# EAGLE design voice board kombi w gp ordered-210217 (EAGLE 6.5.0)
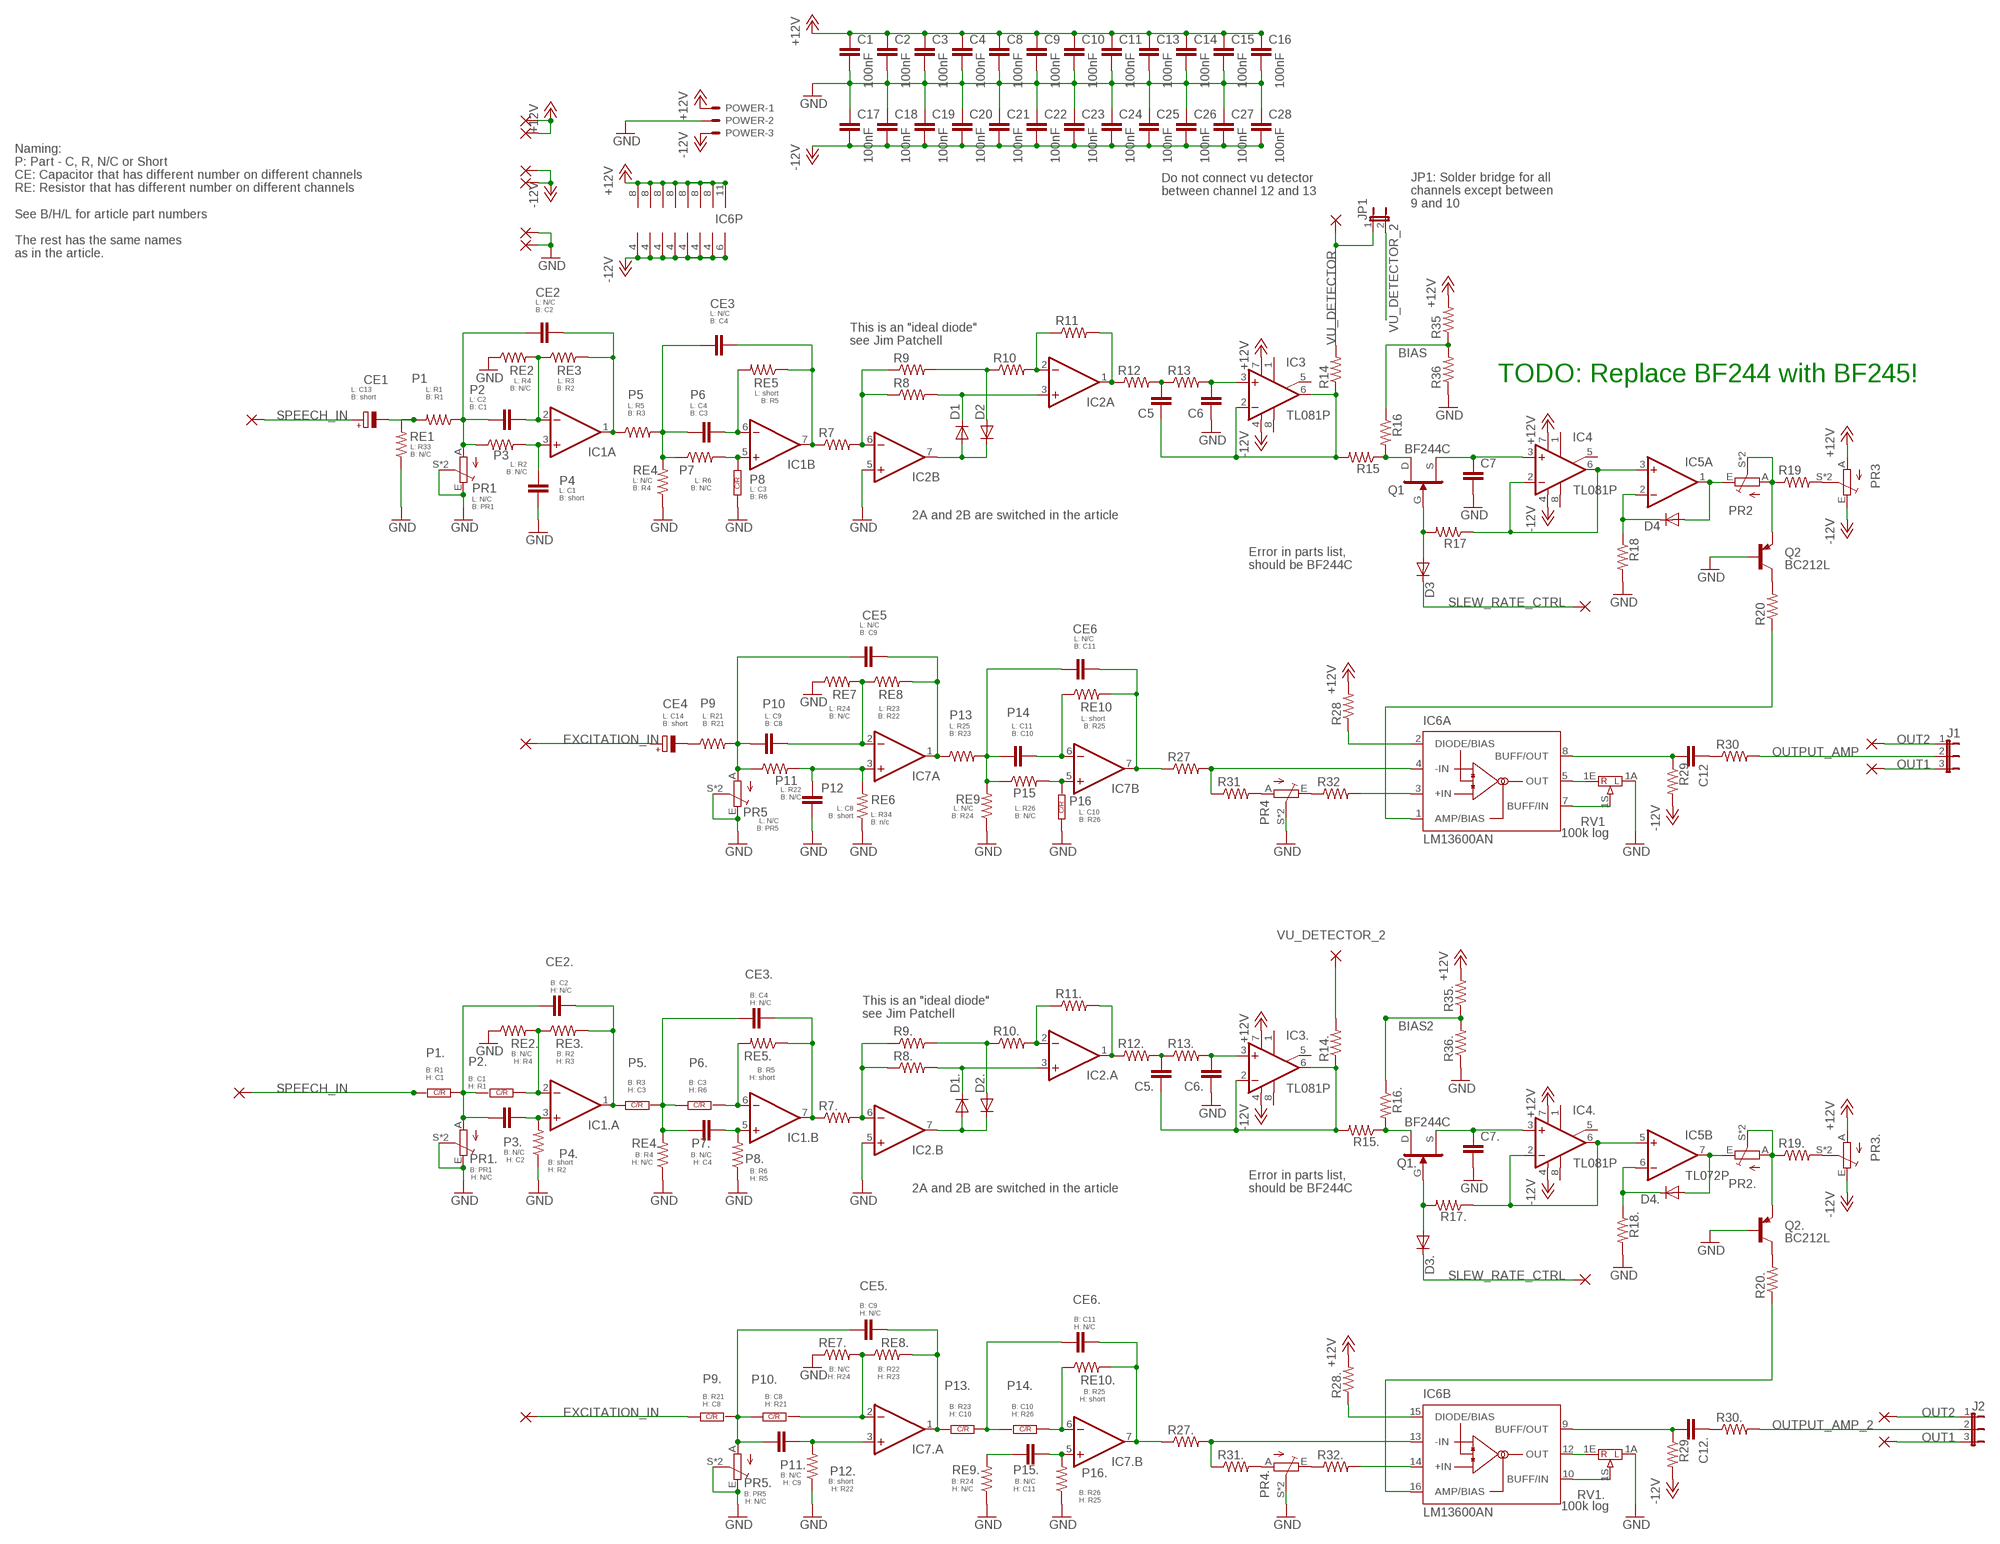
[diagram p0: schematic, sheet 1]

## Parts
C1  100nF  C-EUC0603  [C0603]
C2  100nF  C-EUC0603  [C0603]
C3  100nF  C-EUC0603  [C0603]
C4  100nF  C-EUC0603  [C0603]
C5  C-EU050-035X075  [C050-035X075]
C5.  C-EU050-035X075  [C050-035X075]
C6  C-EU050-035X075  [C050-035X075]
C6.  C-EU050-035X075  [C050-035X075]
C7  C-EU050-035X075  [C050-035X075]
C7.  C-EU050-035X075  [C050-035X075]
C8  100nF  C-EUC0603  [C0603]
C9  100nF  C-EUC0603  [C0603]
C10  100nF  C-EUC0603  [C0603]
C11  100nF  C-EUC0603  [C0603]
C12  C-EU050-035X075  [C050-035X075]
C12.  C-EU050-035X075  [C050-035X075]
C13  100nF  C-EUC0603  [C0603]
C14  100nF  C-EUC0603  [C0603]
C15  100nF  C-EUC0603  [C0603]
C16  100nF  C-EUC0603  [C0603]
C17  100nF  C-EUC0603  [C0603]
C18  100nF  C-EUC0603  [C0603]
C19  100nF  C-EUC0603  [C0603]
C20  100nF  C-EUC0603  [C0603]
C21  100nF  C-EUC0603  [C0603]
C22  100nF  C-EUC0603  [C0603]
C23  100nF  C-EUC0603  [C0603]
C24  100nF  C-EUC0603  [C0603]
C25  100nF  C-EUC0603  [C0603]
C26  100nF  C-EUC0603  [C0603]
C27  100nF  C-EUC0603  [C0603]
C28  100nF  C-EUC0603  [C0603]
CE1  CPOL-EUE2-4  [E2-4]
CE2  C-EU050-035X075  [C050-035X075]
CE2.  C-EU050-035X075  [C050-035X075]
CE3  C-EU050-035X075  [C050-035X075]
CE3.  C-EU050-035X075  [C050-035X075]
CE4  CPOL-EUE2-4  [E2-4]
CE5  C-EU050-035X075  [C050-035X075]
CE5.  C-EU050-035X075  [C050-035X075]
CE6  C-EU050-035X075  [C050-035X075]
CE6.  C-EU050-035X075  [C050-035X075]
D1  DIODE-D-5  [D-5]
D1.  DIODE-D-5  [D-5]
D2  DIODE-D-5  [D-5]
D2.  DIODE-D-5  [D-5]
D3  DIODE-D-5  [D-5]
D3.  DIODE-D-5  [D-5]
D4  DIODE-D-5  [D-5]
D4.  DIODE-D-5  [D-5]
IC1  TL072P  [DIL08]
IC1.  TL072P  [DIL08]
IC2  TL072P  [DIL08]
IC2.  TL072P  [DIL08]
IC3  TL081P  [DIL08]
IC3.  TL081P  [DIL08]
IC4  TL081P  [DIL08]
IC4.  TL081P  [DIL08]
IC5  TL072P  [DIL08]
IC6  LM13600AN  [DIL16]
IC7  TL072P  [DIL08]
IC7.  TL072P  [DIL08]
J1  JP2E  [JP2]
J2  JP2E  [JP2]
JP1  JP1E  [JP1]
P1  R-US_0207/7  [0207/7]
P1.  C-OR-R050_075-035X100  [P050_075-035X100J]
P2  C-EU050-035X075  [C050-035X075]
P2.  C-OR-R050_075-035X100  [P050_075-035X100J]
P3  R-US_0207/7  [0207/7]
P3.  C-EU050-035X075  [C050-035X075]
P4  C-EU050-035X075  [C050-035X075]
P4.  R-US_0207/7  [0207/7]
P5  R-US_0207/7  [0207/7]
P5.  C-OR-R050_075-035X100  [P050_075-035X100J]
P6  C-EU050-035X075  [C050-035X075]
P6.  C-OR-R050_075-035X100  [P050_075-035X100J]
P7  R-US_0207/7  [0207/7]
P7.  C-EU050-035X075  [C050-035X075]
P8  C-OR-R050_075-035X100  [P050_075-035X100J]
P8.  R-US_0207/7  [0207/7]
P9  R-US_0207/7  [0207/7]
P9.  C-OR-R050_075-035X100  [P050_075-035X100J]
P10  C-EU050-035X075  [C050-035X075]
P10.  C-OR-R050_075-035X100  [P050_075-035X100J]
P11  R-US_0207/7  [0207/7]
P11.  C-EU050-035X075  [C050-035X075]
P12  C-EU050-035X075  [C050-035X075]
P12.  R-US_0207/7  [0207/7]
P13  R-US_0207/7  [0207/7]
P13.  C-OR-R050_075-035X100  [P050_075-035X100J]
P14  C-EU050-035X075  [C050-035X075]
P14.  C-OR-R050_075-035X100  [P050_075-035X100J]
P15  R-US_0207/7  [0207/7]
P15.  C-EU050-035X075  [C050-035X075]
P16  C-OR-R050_075-035X100  [P050_075-035X100J]
P16.  R-US_0207/7  [0207/7]
PAD1  WIREPAD2,54/1,1  [2,54/1,1]
PAD2  WIREPAD2,54/1,1  [2,54/1,1]
PAD3  WIREPAD2,54/1,1  [2,54/1,1]
PAD4  WIREPAD2,54/1,1  [2,54/1,1]
PAD5  WIREPAD2,54/1,1  [2,54/1,1]
PAD6  WIREPAD2,54/1,1  [2,54/1,1]
PAD7  WIREPAD2,54/1,1  [2,54/1,1]
PAD8  WIREPAD2,54/1,1  [2,54/1,1]
PAD9  WIREPAD2,54/1,1  [2,54/1,1]
PAD10  WIREPAD2,54/1,1  [2,54/1,1]
PAD11  WIREPAD2,54/1,1  [2,54/1,1]
PAD12  WIREPAD2,54/1,1  [2,54/1,1]
PAD13  WIREPAD2,54/1,1  [2,54/1,1]
PAD14  WIREPAD2,54/1,1  [2,54/1,1]
PAD15  WIREPAD2,54/1,1  [2,54/1,1]
PAD16  WIREPAD2,54/1,1  [2,54/1,1]
PAD17  WIREPAD2,54/1,1  [2,54/1,1]
PAD18  WIREPAD2,54/1,1  [2,54/1,1]
POWER  KK-156-3  [KK-156-3]
PR1  TRIM_EU-PT10-R065  [MULTIPOT_2_J]
PR1.  TRIM_EU-PT10-R065  [MULTIPOT_2_J]
PR2  TRIM_EU-PT10-R065  [MULTIPOT_2_J]
PR2.  TRIM_EU-PT10-R065  [MULTIPOT_2_J]
PR3  TRIM_EU-PT10-R065  [MULTIPOT_2_J]
PR3.  TRIM_EU-PT10-R065  [MULTIPOT_2_J]
PR4  TRIM_EU-PT10-R065  [MULTIPOT_2_J]
PR4.  TRIM_EU-PT10-R065  [MULTIPOT_2_J]
PR5  TRIM_EU-PT10-R065  [MULTIPOT_2_J]
PR5.  TRIM_EU-PT10-R065  [MULTIPOT_2_J]
Q1  BF244C  N-CHANNEL-JFET-JIL-DGSD  [TO92-DGSD-J]
Q1.  BF244C  N-CHANNEL-JFET-JIL-DGSD  [TO92-DGSD-J]
Q2  BC212L  -PNP-TO92-ECB  [TO92-ECB]
Q2.  BC212L  -PNP-TO92-ECB  [TO92-ECB]
R7  R-US_0207/7  [0207/7]
R7.  R-US_0207/7  [0207/7]
R8  R-US_0207/7  [0207/7]
R8.  R-US_0207/7  [0207/7]
R9  R-US_0207/7  [0207/7]
R9.  R-US_0207/7  [0207/7]
R10  R-US_0207/7  [0207/7]
R10.  R-US_0207/7  [0207/7]
R11  R-US_0207/7  [0207/7]
R11.  R-US_0207/7  [0207/7]
R12  R-US_0207/7  [0207/7]
R12.  R-US_0207/7  [0207/7]
R13  R-US_0207/7  [0207/7]
R13.  R-US_0207/7  [0207/7]
R14  R-US_0207/7  [0207/7]
R14.  R-US_0207/7  [0207/7]
R15  R-US_0207/7  [0207/7]
R15.  R-US_0207/7  [0207/7]
R16  R-US_0207/7  [0207/7]
R16.  R-US_0207/7  [0207/7]
R17  R-US_0207/7  [0207/7]
R17.  R-US_0207/7  [0207/7]
R18  R-US_0207/7  [0207/7]
R18.  R-US_0207/7  [0207/7]
R19  R-US_0207/7  [0207/7]
R19.  R-US_0207/7  [0207/7]
R20  R-US_0207/7  [0207/7]
R20.  R-US_0207/7  [0207/7]
R27  R-US_0207/7  [0207/7]
R27.  R-US_0207/7  [0207/7]
R28  R-US_0207/7  [0207/7]
R28.  R-US_0207/7  [0207/7]
R29  R-US_0207/7  [0207/7]
R29.  R-US_0207/7  [0207/7]
R30  R-US_0207/7  [0207/7]
R30.  R-US_0207/7  [0207/7]
R31  R-US_0207/7  [0207/7]
R31.  R-US_0207/7  [0207/7]
R32  R-US_0207/7  [0207/7]
R32.  R-US_0207/7  [0207/7]
R35  R-US_0207/7  [0207/7]
R35.  R-US_0207/7  [0207/7]
R36  R-US_0207/7  [0207/7]
R36.  R-US_0207/7  [0207/7]
RE1  R-US_0207/7  [0207/7]
RE2  R-US_0207/7  [0207/7]
RE2.  R-US_0207/7  [0207/7]
RE3  R-US_0207/7  [0207/7]
RE3.  R-US_0207/7  [0207/7]
RE4  R-US_0207/7  [0207/7]
RE4.  R-US_0207/7  [0207/7]
RE5  R-US_0207/7  [0207/7]
RE5.  R-US_0207/7  [0207/7]
RE6  R-US_0204/7  [0204/7]
RE7  R-US_0207/7  [0207/7]
RE7.  R-US_0207/7  [0207/7]
RE8  R-US_0207/7  [0207/7]
RE8.  R-US_0207/7  [0207/7]
RE9  R-US_0207/7  [0207/7]
RE9.  R-US_0207/7  [0207/7]
RE10  R-US_0207/7  [0207/7]
RE10.  R-US_0207/7  [0207/7]
RV1  100k log  POT16_W_BRACKET""  [POT16_W_BRACKET-J]
RV1.  100k log  POT16_W_BRACKET""  [POT16_W_BRACKET-J]

## Nets
+12V: C1.1 C2.1 C3.1 C4.1 C8.1 C9.1 C10.1 C11.1 C13.1 C14.1 C15.1 C16.1 IC1.8(P:V+) IC1..8(P:V+) IC2.8(P:V+) IC2..8(P:V+) IC3.7(V+) IC3..7(V+) IC4.7(V+) IC4..7(V+) IC5.8(P:V+) IC6.11(P:V+) IC7.8(P:V+) IC7..8(P:V+) PAD9.1(P) PAD10.1(P) POWER.1 PR3..A PR3.A R28.2 R28..2 R35.2 R35..2
-12V: C17.2 C18.2 C19.2 C20.2 C21.2 C22.2 C23.2 C24.2 C25.2 C26.2 C27.2 C28.2 IC1.4(P:V-) IC1..4(P:V-) IC2.4(P:V-) IC2..4(P:V-) IC3.4(V-) IC3..4(V-) IC4.4(V-) IC4..4(V-) IC5.4(P:V-) IC6.6(P:V-) IC7.4(P:V-) IC7..4(P:V-) PAD13.1(P) PAD14.1(P) POWER.3 PR3..E PR3.E R29.2 R29..2
BIAS: R16.1 R35.1 R36.2
BIAS2: R16..1 R35..1 R36..2
EXCITATION_IN: CE4.+ P9..1 PAD3.1(P) PAD4.1(P)
GND: C1.2 C2.2 C3.2 C4.2 C6.1 C6..1 C7.2 C7..2 C8.2 C9.2 C10.2 C11.2 C13.2 C14.2 C15.2 C16.2 C17.1 C18.1 C19.1 C20.1 C21.1 C22.1 C23.1 C24.1 C25.1 C26.1 C27.1 C28.1 IC2.5(B:+IN) IC2..5(B:+IN) P4.1 P4..1 P8.1 P8..1 P12.1 P12..1 P16.1 P16..1 PAD15.1(P) PAD16.1(P) POWER.2 PR1..E PR1..S PR1..S0(S) PR1.E PR1.S PR1.S0(S) PR4..S PR4..S0(S) PR4.S PR4.S0(S) PR5..E PR5..S PR5..S0(S) PR5.E PR5.S PR5.S0(S) Q2..B Q2.B R18.2 R18..2 R36.1 R36..1 RE1.1 RE2.1 RE2..1 RE4.1 RE4..1 RE6.1 RE7.1 RE7..1 RE9.1 RE9..1 RV1.1A RV1..1A
N$1: IC1.2(A:-IN) P2.2 RE2.2 RE3.1
N$2: CE2.1 P1.1 P2.1 P3.1 PR1.A
N$3: CE2.2 IC1.1(A:OUT) P5.1 RE3.2
N$4: IC2.6(B:-IN) R7.2 R8.1 R9.1
N$5: CE3.1 P5.2 P6.1 P7.1 RE4.2
N$6: IC1.6(B:-IN) P6.2 RE5.2
N$7: IC1.5(B:+IN) P7.2 P8.2 P8.3
N$8: CE3.2 IC1.7(B:OUT) R7.1 RE5.1
N$9: D1.C IC2.3(A:+IN) R8.2
N$10: D1.A D2.C IC2.7(B:OUT)
N$11: D2.A R9.2 R10.1
N$12: IC2.2(A:-IN) R10.2 R11.1
N$13: IC2.1(A:OUT) R11.2 R12.1
N$14: C5.2 R12.2 R13.1
N$15: C5.1 IC3.2(-IN) IC3.6(OUT) R14.1 R15.2
N$16: C6.2 IC3.3(+IN) R13.2
N$17: Q1.D Q1.D2(D) R15.1 R16.2
N$18: C7.1 IC4.3(+IN) Q1.S
N$19: D3.A Q1.G R17.2
N$20: IC4.2(-IN) IC4.6(OUT) IC5.3(A:+IN) R17.1
N$21: D4.C IC5.2(A:-IN) R18.1
N$22: D4.A IC5.1(A:OUT) PR2.E
N$23: PR2.A PR2.S PR2.S0(S) Q2.E R19.1
N$24: PR3.S PR3.S0(S) R19.2
N$25: Q2.C R20.2
N$26: PR4.A R31.2
N$27: CE5.2 P9.2 P10.2 P11.1 PR5.A
N$28: CE6.2 P13.2 P14.2 P15.1 RE9.2
N$29: IC7.2(A:-IN) P10.1 RE7.2 RE8.1
N$30: CE5.1 IC7.1(A:OUT) P13.1 RE8.2
N$31: IC7.6(B:-IN) P14.1 RE10.1
N$32: IC7.5(B:+IN) P15.2 P16.2 P16.3
N$33: C12.2 IC6.8(A:BUFF/OUT) R29.1
N$34: C12.1 R30.1
N$35: CE6.1 IC7.7(B:OUT) R27.1 RE10.2
N$36: PR4.E R32.1
N$37: IC6.3(A:+IN) R32.2
N$38: IC6.2(A:DIODE/BIAS) R28.1
N$39: IC6.4(A:-IN) R27.2 R31.1
N$40: IC6.1(A:AMP/BIAS) R20.1
N$41: IC6.5(A:OUT) RV1.1E
N$42: IC6.7(A:BUFF/IN) RV1.1S
N$43: CE1.- P1.2 RE1.2
N$44: IC1.3(A:+IN) P3.2 P4.2
N$45: CE4.- P9.1
N$46: IC7.3(A:+IN) P11.2 P12.2 RE6.2
N$47: IC1..2(A:-IN) P2..1 RE2..2 RE3..1
N$48: CE2..1 P1..1 P2..2 P2..3 P3..1 PR1..A
N$49: CE2..2 IC1..1(A:OUT) P5..1 RE3..2
N$50: CE3..1 P5..2 P5..3 P6..1 P7..1 RE4..2
N$51: IC1..6(B:-IN) P6..2 P6..3 RE5..2
N$52: IC1..5(B:+IN) P7..2 P8..2
N$53: CE3..2 IC1..7(B:OUT) R7..1 RE5..1
N$54: IC2..6(B:-IN) R7..2 R8..1 R9..1
N$55: D1..C IC2..3(A:+IN) R8..2
N$56: D1..A D2..C IC2..7(B:OUT)
N$57: D2..A R9..2 R10..1
N$58: IC2..2(A:-IN) R10..2 R11..1
N$59: IC2..1(A:OUT) R11..2 R12..1
N$60: C5..2 R12..2 R13..1
N$61: C5..1 IC3..2(-IN) IC3..6(OUT) R14..1 R15..2
N$62: C6..2 IC3..3(+IN) R13..2
N$63: Q1..D Q1..D2(D) R15..1 R16..2
N$64: C7..1 IC4..3(+IN) Q1..S
N$65: D3..A Q1..G R17..2
N$66: IC4..2(-IN) IC4..6(OUT) IC5.5(B:+IN) R17..1
N$67: D4..C IC5.6(B:-IN) R18..1
N$68: D4..A IC5.7(B:OUT) PR2..E
N$69: PR2..A PR2..S PR2..S0(S) Q2..E R19..1
N$70: PR3..S PR3..S0(S) R19..2
N$71: Q2..C R20..2
N$72: PR4..A R31..2
N$73: CE5..2 P9..2 P9..3 P10..1 P11..1 PR5..A
N$74: CE6..2 P13..1 P14..2 P14..3
N$75: IC7..2(A:-IN) P10..2 P10..3 RE7..2 RE8..1
N$76: CE5..1 IC7..1(A:OUT) P13..2 P13..3 RE8..2
N$77: CE6..1 IC7..7(B:OUT) R27..1 RE10..2
N$78: PR4..E R32..1
N$79: IC6.14(B:+IN) R32..2
N$80: IC6.15(B:DIODE/BIAS) R28..1
N$81: IC6.13(B:-IN) R27..2 R31..1
N$82: IC6.16(B:AMP/BIAS) R20..1
N$83: IC6.10(B:BUFF/IN) RV1..1S
N$84: C12..2 IC6.9(B:BUFF/OUT) R29..1
N$85: C12..1 R30..1
N$86: IC7..6(B:-IN) P14..1 RE10..1
N$87: IC7..5(B:+IN) P15..2 P16..2
N$88: P15..1 RE9..2
N$89: IC1..3(A:+IN) P3..2 P4..2
N$91: IC7..3(A:+IN) P11..2 P12..2
N$92: IC6.12(B:OUT) RV1..1E
OUT1: J1.3 J2.3 PAD1.1(P) PAD2.1(P)
OUT2: J1.1 J2.1 PAD17.1(P) PAD18.1(P)
OUTPUT_AMP: J1.2 R30.2
OUTPUT_AMP_2: J2.2 R30..2
SLEW_RATE_CTRL: D3..C D3.C PAD11.1(P) PAD12.1(P)
SPEECH_IN: CE1.+ P1..2 P1..3 PAD5.1(P) PAD6.1(P)
VU_DETECTOR: JP1.1 PAD7.1(P) R14.2
VU_DETECTOR_2: JP1.2 PAD8.1(P) R14..2
Unconnected: IC3.1(ON1) IC3.5(ON2) IC3.8(OPT) IC3..1(ON1) IC3..5(ON2) IC3..8(OPT) IC4.1(ON1) IC4.5(ON2) IC4.8(OPT) IC4..1(ON1) IC4..5(ON2) IC4..8(OPT) RV1..M1 RV1..M2 RV1..M3 RV1..M4 RV1.M1 RV1.M2 RV1.M3 RV1.M4

## Notes on the sheet
- Do not connect vu detector 
  between channel 12 and 13
- JP1: Solder bridge for all 
  channels except between 
  9 and 10
- Naming:
  P: Part - C, R, N/C or Short
  CE: Capacitor that has different number on different channels
  RE: Resistor that has different number on different channels
  
  See B/H/L for article part numbers
  
  The rest has the same names 
  as in the article.
- L: N/C
  B: C2
- L: N/C
  B: C4
- This is an "ideal diode"
  see Jim Patchell
- L: R4
  B: N/C
- L: R3
  B: R2
- TODO: Replace BF244 with BF245!
- L: short
  B: R5
- L: C13
  B: short
- L: R1
  B: R1
- L: C2
  B: C1
- L: R5
  B: R3
- L: C4
  B: C3
- L: R33
  B: N/C
- L: R2
  B: N/C
- L: R6
  B: N/C
- L: N/C
  B: R4
- L: C3
  B: R6
- L: C1
  B: short
- L: N/C
  B: PR1
- 2A and 2B are switched in the article
- Error in parts list, 
  should be BF244C
- L: N/C
  B: C9
- L: N/C
  B: C11
- L: R24
  B: N/C
- L: R23
  B: R22
- L: short
  B: R25
- L: C14
  B: short
- L: R21
  B: R21
- L: C9
  B: C8
- L: R25
  B: R23
- L: C11
  B: C10
- L: R22
  B: N/C
- L: C8
  B: short
- L: N/C
  B: R24
- L: R26
  B: N/C
- L: N/C
  B: PR5
- L: C10
  B: R26
- L: R34
  B: n/c
- B: C2
  H: N/C
- B: C4
  H: N/C
- This is an "ideal diode"
  see Jim Patchell
- B: N/C
  H: R4
- B: R2
  H: R3
- B: R5
  H: short
- B: R1
  H: C1
- B: C1
  H: R1
- B: R3
  H: C3
- B: C3
  H: R6
- B: N/C
  H: C2
- B: R4
  H: N/C
- B: N/C
  H: C4
- B: PR1
  H: N/C
- B: short
  H: R2
- B: R6
  H: R5
- 2A and 2B are switched in the article
- Error in parts list, 
  should be BF244C
- B: C9
  H: N/C
- B: C11
  H: N/C
- B: N/C
  H: R24
- B: R22
  H: R23
- B: R25
  H: short
- B: R21
  H: C8
- B: C8
  H: R21
- B: R23
  H: C10
- B: C10
  H: R26
- B: N/C
  H: C9
- B: short
  H: R22
- B: R24
  H: N/C
- B: N/C
  H: C11
- B: PR5
  H: N/C
- B: R26
  H: R25

## Library data of the parts
C1-C5 C5. C6 C6. C7 C7. C8-C12 C12. C13-C28 CE2 CE2. CE3 CE3. CE5 CE5. CE6 CE6. P2 P3. P4 P6 P7. P10 P11. P12 P14 P15. = resistor:C-EU: CAPACITOR, European symbol
CE1 CE4 = resistor:CPOL-EU: POLARIZED CAPACITOR, European symbol
D1 D1. D2 D2. D3 D3. D4 D4. = diode:DIODE-: DIODE
IC1 IC1. IC2 IC2. IC5 IC7 IC7. = linear:TL072: OP AMP
IC3 IC3. IC4 IC4. = linear:TL081: OP AMP
IC6 = national-semiconductor:LM13600: Dual Operational Transconductance Amplifiers with Linearizing Diodes and Buffers Source: lm13600.PDF
J1 J2 = jumper:JP2E: JUMPER
JP1 = jumper:JP1E: JUMPER
P1 P3 P4. P5 P7 P8. P9 P11 P12. P13 P15 P16. R7 R7. R8 R8. R9 R9. R10 R10. R11 R11. R12 R12. R13 R13. R14 R14. R15 R15. R16 R16. R17 R17. R18 R18. R19 R19. R20 R20. R27 R27. R28 R28. R29 R29. R30 R30. R31 R31. R32 R32. R35 R35. R36 R36. RE1 RE2 RE2. RE3 RE3. RE4 RE4. RE5 RE5. RE6 RE7 RE7. RE8 RE8. RE9 RE9. RE10 RE10. = resistor:R-US_: RESISTOR, American symbol
P1. P2. P5. P6. P8 P9. P10. P13. P14. P16 = joakim:C-OR-R: Combined part for resistors and capacitors
PAD1-PAD18 = wirepad:WIREPAD: Wire PAD connect wire on PCB
POWER = con-molex:KK-156-3: KK 156 HEADER Source: http://www.molex.com/pdm_docs/sd/026604100_sd.pdf; OC_FARNELL: unknown; OC_NEWARK: unknown
PR1 PR1. PR2 PR2. PR3 PR3. PR4 PR4. PR5 PR5. = joakim:TRIM_EU-: POTENTIOMETER
Q1 Q1. = joakim:N-CHANNEL-JFET-J: N-Channel JFET RF Amplifier
Q2 Q2. = transistor-neu-to92:*-PNP-: PNP Transistror
RV1 RV1. = joakim:POT16_W_BRACKET: POTENTIOMETER potentiometer, 16 mm w 5mm pitch and OMEG bracket, 17,8 x 7,5 mm

## Board
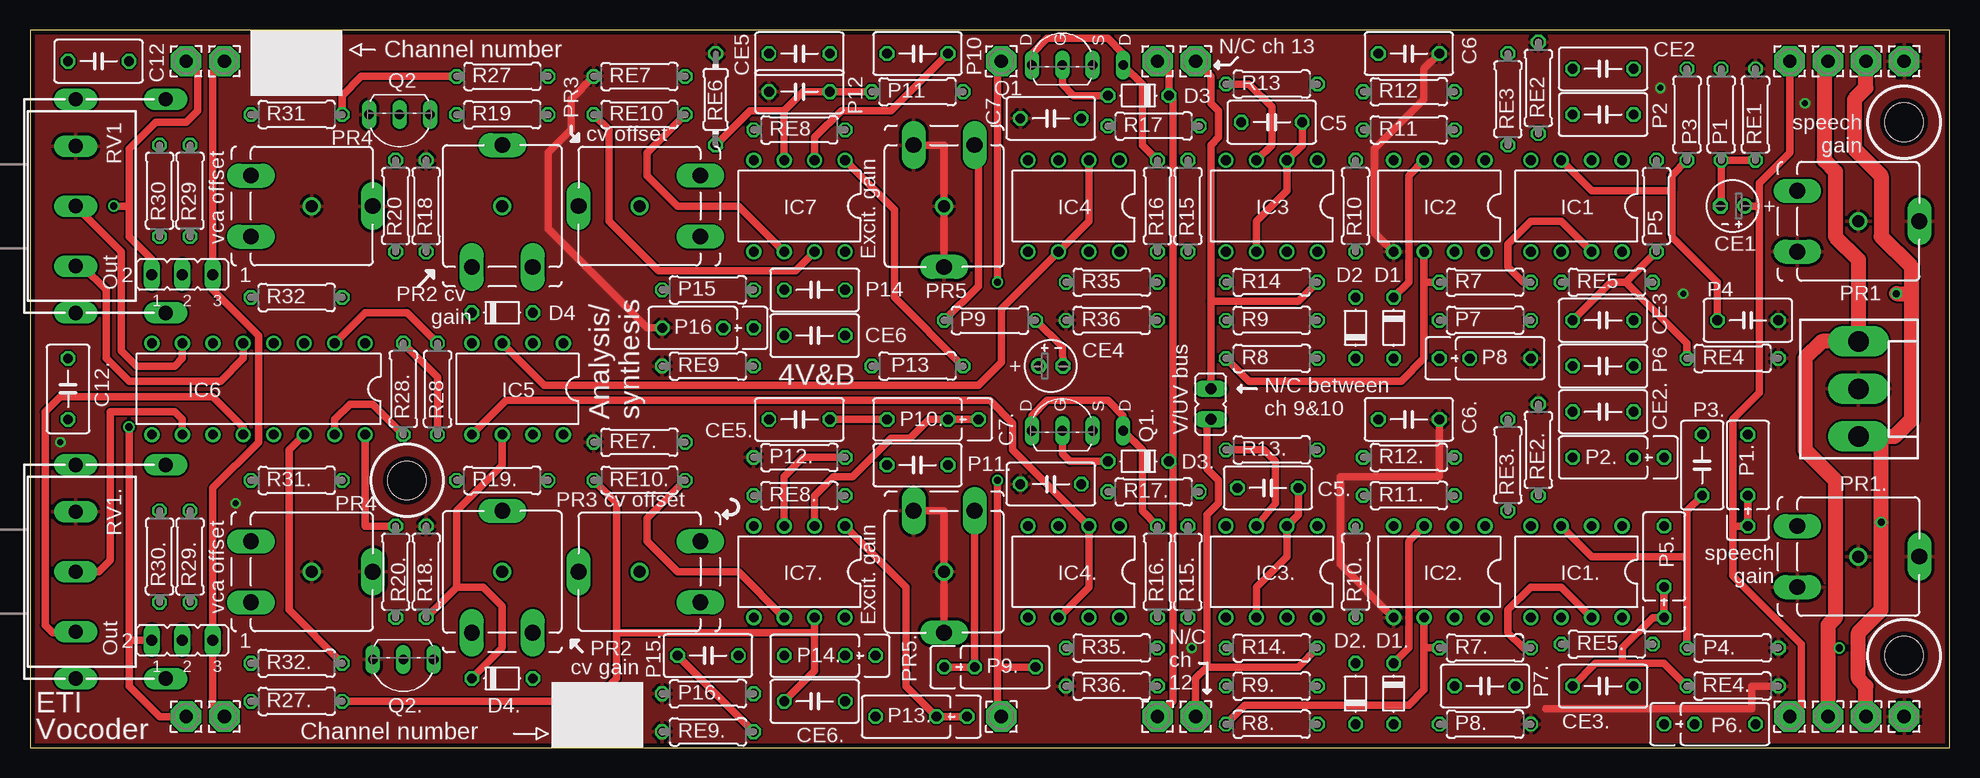
[diagram p1: board, top side]
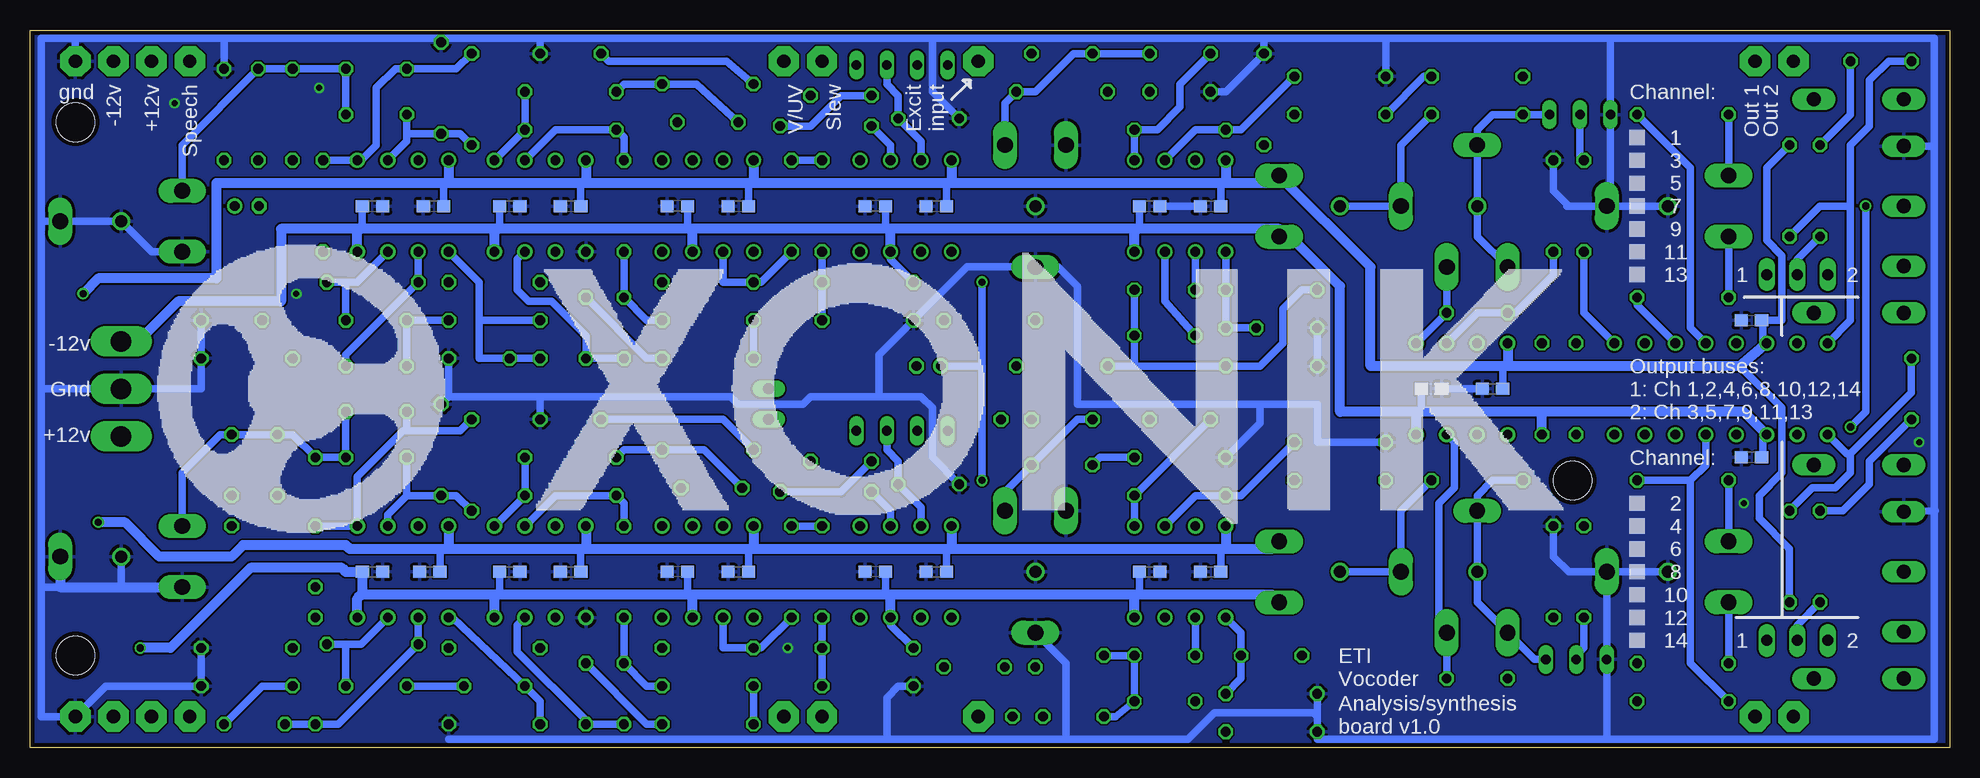
[diagram p2: board, bottom side, seen from below]

Size 160 x 59.82 mm. Coordinates in mm from the lower left corner, seen from the top.
Outline: 0,0 160,0 160,59.82 0,59.82 0,0
Copper layers (1*16): Top 0.0356mm / dielectric 1.5011mm / Bottom 0.0356mm
Design rules "oshpark-2layer": minimum track width 6mil, minimum drill 13mil, track to track 6mil, track to pad 6mil, pad to pad 6mil, via to via 6mil, smd to smd 6mil, copper to edge 15mil, drill to drill 6mil, minimum pad ring 7mil, minimum via ring 7mil, stop-mask expansion 2.5mil, vias tented up to drill 0mil, thermal gap 10mil
Holes 3.2 mm at 156.21,52.13 156.21,7.68 31.43,22.29

### Footprints (pad centres in the part's own frame; a part is rotated, then mirrored left to right if it is on the bottom)
C0603 = smd 1.1 x 1: 1 -0.85,0; 2 0.85,0
C050-035X075 = drill 0.813 octagon: 1 -2.54,0; 2 2.54,0
E2-4 = drill 0.813 pad 1.27: + -1.016,0 | drill 0.813 pad 1.27 octagon: - 1.016,0
D-5 = drill 0.813 octagon: A 2.54,0; C -2.54,0
DIL08 = drill 0.813 pad 1.27: 1 -3.81,-3.81; 2 -1.27,-3.81; 3 1.27,-3.81; 4 3.81,-3.81; 5 3.81,3.81; 6 1.27,3.81; 7 -1.27,3.81; 8 -3.81,3.81
DIL16 = drill 0.813 pad 1.27: 1 -8.89,-3.81; 2 -6.35,-3.81; 3 -3.81,-3.81; 4 -1.27,-3.81; 5 1.27,-3.81; 6 3.81,-3.81; 7 6.35,-3.81; 8 8.89,-3.81; 9 8.89,3.81; 10 6.35,3.81; 11 3.81,3.81; 12 1.27,3.81; 13 -1.27,3.81; 14 -3.81,3.81; 15 -6.35,3.81; 16 -8.89,3.81
JP2 = drill 0.914 long: 1 -2.54,0; 2 0,0; 3 2.54,0
JP1 = drill 0.914 long: 1 0,-1.27; 2 0,1.27
0207/7 = drill 0.813 octagon: 1 -3.81,0; 2 3.81,0
P050_075-035X100J = drill 0.813 octagon: 1 -3.81,0; 2 1.27,0; 3 3.81,0
2,54/1,1 = drill 1.118 pad 2.54 octagon: 1 0,0
KK-156-3 = drill 1.7 pad 2.184 long: 1 -3.96,0; 2 0,0; 3 3.96,0
MULTIPOT_2_J = drill 1.321 long: A -2.54,-5.08; E 2.54,-5.08; S 0,5.08 | drill 1: S0 0,0
TO92-DGSD-J = drill 0.813 long: D 5.08,0; D2 -2.54,0; G 0,0; S 2.54,0
TO92-ECB = drill 0.813 long: B 2.54,0; C 0,0; E -2.54,0
0204/7 = drill 0.813 octagon: 1 -3.81,0; 2 3.81,0
POT16_W_BRACKET-J = drill 1.2 long: 1A -5,0; 1E 5,0; 1S 0,0; M1 -8.9,0; M2 8.9,0; M3 8.9,7.5; M4 -8.9,7.5

### Placement (x,y rotation side)
C1  16.51,24.19 180 bottom
C2  120.02,14.67 0 bottom
C3  43.18,29.91 0 bottom
C4  131.44,14.67 0 bottom
C5  103.5,52.13 180 top
C5.  103.19,21.65 180 top
C6  114.94,57.85 180 top
C6.  114.94,27.37 180 top
C7  85.09,52.45 180 top
C7.  85.09,21.97 180 top
C8  66.67,14.67 0 bottom
C9  66.67,45.15 0 bottom
C10  89.53,45.15 180 bottom
C11  106.05,45.15 180 bottom
C12  5.71,57.21 180 top
C12.  3.17,29.91 90 top
C13  89.53,14.67 180 bottom
C14  106.05,14.67 180 bottom
C15  120.02,45.15 0 bottom
C16  131.44,45.15 0 bottom
C17  100.97,14.67 0 bottom
C18  61.59,45.15 0 bottom
C19  126.68,14.67 0 bottom
C20  100.97,45.15 0 bottom
C21  61.59,14.67 0 bottom
C22  16.51,35.62 0 bottom
C23  38.1,29.91 0 bottom
C24  84.45,45.15 0 bottom
C25  114.94,45.15 0 bottom
C26  84.45,14.67 0 bottom
C27  126.36,45.15 0 bottom
C28  114.94,14.67 0 bottom
CE1  141.92,45.15 180 top
CE2  131.13,56.58 180 top
CE2.  131.13,28 180 top
CE3  131.13,35.62 0 top
CE3.  131.13,5.14 0 top
CE4  85.09,31.81 0 top
CE5  64.14,57.85 0 top
CE5.  64.14,27.37 0 top
CE6  65.41,34.35 0 top
CE6.  65.41,3.87 0 top
D1  113.67,34.99 270 top
D1.  113.67,4.51 270 top
D2  110.49,34.99 90 top
D2.  110.49,4.51 90 top
D3  92.39,54.36 180 top
D3.  92.39,23.88 180 top
D4  39.37,36.26 0 top
D4.  39.37,5.78 0 top
IC1  128.91,45.15 180 top
IC1.  128.91,14.67 180 top
IC2  117.47,45.15 180 top
IC2.  117.47,14.67 180 top
IC3  103.5,45.15 180 top
IC3.  103.5,14.67 180 top
IC4  87,45.15 180 top
IC4.  87,14.67 180 top
IC5  40.64,29.91 180 top
IC6  19.05,29.91 180 top
IC7  64.14,45.15 180 top
IC7.  64.14,14.67 180 top
J1  12.7,39.43 0 top
J2  12.7,8.95 0 top
JP1  98.42,28.64 180 top
P1  140.97,52.77 270 top
P1.  143.19,22.29 270 top
P2  131.13,52.77 180 top
P2.  132.4,24.19 0 top
P3  138.11,52.77 270 top
P3.  139.38,23.56 270 top
P4  143.19,35.62 180 top
P4.  141.92,8.32 180 top
P5  135.57,45.15 270 top
P5.  136.21,14.67 270 top
P6  131.13,31.81 0 top
P6.  140.02,1.97 180 top
P7  121.28,35.62 180 top
P7.  121.28,5.14 180 top
P8  121.28,32.45 180 top
P8.  121.28,1.97 180 top
P9  80.01,35.62 180 top
P9.  80.01,6.73 180 top
P10  73.98,57.85 180 top
P10.  75.25,27.37 0 top
P11  73.98,54.67 180 top
P11.  73.98,23.56 180 top
P12  64.14,54.67 0 top
P12.  64.14,24.19 0 top
P13  73.98,31.81 180 top
P13.  74.3,2.6 0 top
P14  65.41,38.16 0 top
P14.  66.67,7.68 0 top
P15  56.52,38.16 0 top
P15.  56.52,7.68 0 top
P16  56.52,34.99 0 top
P16.  56.52,4.51 0 top
PAD1  16.19,57.21 0 top
PAD2  16.19,2.6 0 top
PAD3  80.96,57.21 0 top
PAD4  80.96,2.6 0 top
PAD5  146.69,57.21 0 top
PAD6  146.69,2.6 0 top
PAD7  97.16,57.21 0 top
PAD8  97.16,2.6 0 top
PAD9  149.86,2.6 0 top
PAD10  149.86,57.21 0 top
PAD11  93.98,2.6 0 top
PAD12  93.98,57.21 0 top
PAD13  153.03,57.21 0 top
PAD14  153.03,2.6 0 top
PAD15  156.21,57.21 0 top
PAD16  156.21,2.6 0 top
PAD17  13.02,57.21 0 top
PAD18  13.02,2.6 0 top
POWER  152.4,29.91 270 top
PR1  152.4,43.88 270 top
PR1.  152.4,15.94 270 top
PR2  39.37,45.15 0 top
PR2.  39.37,14.67 0 top
PR3  50.8,45.15 90 top
PR3.  50.8,14.67 90 top
PR4  23.5,45.15 270 top
PR4.  23.5,14.67 270 top
PR5  76.2,45.15 180 top
PR5.  76.2,14.67 180 top
Q1  86.04,56.9 0 top
Q1.  86.04,26.42 0 top
Q2  30.8,52.77 180 top
Q2.  31.11,7.37 180 top
R7  121.28,38.8 180 top
R7.  121.28,8.32 180 top
R8  103.5,32.45 0 top
R8.  103.5,1.97 0 top
R9  103.5,35.62 0 top
R9.  103.5,5.14 0 top
R10  110.49,45.15 90 top
R10.  110.49,14.67 90 top
R11  114.94,51.5 0 top
R11.  114.94,21.02 0 top
R12  114.94,54.67 180 top
R12.  114.94,24.19 180 top
R13  103.5,55.31 180 top
R13.  103.5,24.83 180 top
R14  103.5,38.8 0 top
R14.  103.5,8.32 0 top
R15  96.52,45.15 270 top
R15.  96.52,14.67 270 top
R16  93.98,45.15 90 top
R16.  93.98,14.67 90 top
R17  93.66,51.82 0 top
R17.  93.66,21.34 0 top
R18  33.02,45.15 90 top
R18.  33.02,14.67 90 top
R19  39.37,52.77 0 top
R19.  39.37,22.29 0 top
R20  30.48,45.15 90 top
R20.  30.48,14.67 270 top
R27  39.37,55.94 180 top
R27.  22.23,3.87 180 top
R28  33.97,29.91 270 top
R28.  31.11,29.91 90 top
R29  13.34,46.42 90 top
R29.  13.34,15.94 270 top
R30  10.79,46.42 270 top
R30.  10.79,15.94 270 top
R31  22.23,52.77 180 top
R31.  22.23,22.29 180 top
R32  22.23,37.53 0 top
R32.  22.23,7.05 0 top
R35  90.17,38.8 180 top
R35.  90.17,8.32 180 top
R36  90.17,35.62 0 top
R36.  90.17,5.14 0 top
RE1  143.83,52.77 270 top
RE2  125.73,54.99 270 top
RE2.  125.73,24.83 270 top
RE3  123.19,54.04 90 top
RE3.  123.19,23.56 90 top
RE4  141.92,32.45 180 top
RE4.  141.92,5.14 180 top
RE5  131.44,38.8 180 top
RE5.  131.44,8.64 180 top
RE6  57.15,54.04 270 top
RE7  50.8,55.94 0 top
RE7.  50.8,25.46 0 top
RE8  64.14,51.5 0 top
RE8.  64.14,21.02 0 top
RE9  56.52,31.81 0 top
RE9.  56.52,1.33 0 top
RE10  50.8,52.77 180 top
RE10.  50.8,22.29 180 top
RV1  3.81,45.15 270 top
RV1.  3.81,14.67 270 top

### Tracks (layer width: path | path; a pad name or v marks a point on that pad's centre or on a via)
+12V  (via drill 0.6)
  Top 0.61: R28.2 33.97,30.86 R28..2
  Top 0.813: v150.81,8.32 149.86,8.32 149.86,10.22
  Top 1.27: PAD10.1 149.86,56.9 149.54,56.58 149.54,48.96 150.5,48.01 150.5,42.61 152.4,40.7 POWER.1 149.38,33.87 147.96,32.45 147.96,24.83 150.5,22.29 150.5,10.86 149.86,10.22 PAD9.1
  Bottom 0.61: R35.2 88.27,40.7 IC4.7 | R35..2 88.27,10.22 IC4..7 | C1.1 15.56,24.19 15.56,25.78 IC6.11 | C3.1 44.03,28.11 44.13,28 | C9.1 67.53,43.35 67.63,43.24 | C10.1 88.69,43.35 88.58,43.24 | C11.1 105.19,43.35 105.09,43.24 | C15.1 120.86,43.35 120.97,43.24 | C16.1 132.29,43.35 132.4,43.24 | 132.29,12.87 132.4,12.76 | C2.1 120.86,12.87 120.97,12.76 | C13.1 88.69,12.98 88.9,12.76 | C8.1 67.53,12.87 67.63,12.76 | C14.1 105.19,12.87 105.09,12.76
  Bottom 0.813: IC1.8 132.72,43.24 | IC6.11 17.14,28 33.97,28 | R28.2 33.97,28 | 33.97,28 44.13,28 44.45,28 | 44.45,28 50.8,28 50.8,38.48 54.93,42.61 PR3.A 55.88,43.24 67.63,43.24 67.94,43.24 | 67.94,43.24 88.27,43.24 | 88.27,43.24 88.58,43.24 104.78,43.24 | 104.78,43.24 105.09,43.24 120.97,43.24 121.28,43.24 | 121.28,43.24 132.4,43.24 132.72,43.24 | IC2.8 121.28,43.24 | IC3.7 104.78,43.24 | IC4.7 88.27,43.24 | IC7.8 67.94,43.24 | IC5.8 44.45,28 | 132.72,43.24 139.06,43.24 139.06,37.21 147.64,37.21 150.98,33.87 POWER.1 | PR3..A 56.52,12.76 67.63,12.76 67.94,12.76 | 67.94,12.76 88.27,12.76 | 88.27,12.76 88.9,12.76 104.78,12.76 | 104.78,12.76 105.09,12.76 120.97,12.76 121.28,12.76 | 121.28,12.76 132.4,12.76 132.72,12.45 IC1..8 | v150.81,8.32 148.27,8.32 141.6,14.99 133.99,14.99 133.67,14.67 C4.1 132.29,12.87 | IC4..7 88.27,12.76 | IC3..7 104.78,12.76 | IC7..8 67.94,12.76 | IC2..8 121.28,12.76
-12V  (via drill 0.6)
  Top 1.27: PAD14.1 153.03,5.14 152.4,5.78 152.4,9.59 154.31,11.49 v154.31,18.8 154.31,26.1 152.55,26.1 POWER.3 155.43,25.95 156.84,27.37 156.84,37.85 | v155.57,37.85 156.84,37.85 | 156.84,37.85 156.84,40.07 154.31,42.61 154.31,47.69 152.08,49.91 152.08,54.04 153.03,54.99 PAD13.1
  Bottom 0.406: 15.56,35.62 C22.2
  Bottom 0.61: IC6.6 15.56,33.72 15.56,35.62 13.97,35.62 13.97,41.02 15.24,42.29 15.24,48.32 R29.2 | 17.46,31.81 13.97,28.32 13.97,22.92 15.88,21.02 15.88,19.11 13.34,16.57 R29..2 | C23.2 37.25,31.6 37.47,31.81 | C18.2 60.74,46.95 60.64,47.05 | C24.2 83.61,46.95 83.5,47.05 | C20.2 100.11,46.95 100.01,47.05 | C25.2 114.08,46.95 113.98,47.05 | C27.2 125.52,46.84 125.73,47.05 | C19.2 125.83,16.36 126.05,16.57 | C28.2 114.08,16.47 113.98,16.57 | C26.2 83.61,16.47 83.5,16.57 | C21.2 60.74,16.36 60.96,16.57 | C17.2 100.11,16.47 100.01,16.57
  Bottom 0.813: IC6.6 17.46,31.81 36.83,31.81 | 36.83,31.81 37.47,31.81 48.26,31.81 48.26,40.07 PR3.E 55.88,47.05 60.33,47.05 | 60.33,47.05 60.64,47.05 83.19,47.05 | 83.19,47.05 83.5,47.05 99.69,47.05 | 99.69,47.05 100.01,47.05 113.67,47.05 | 113.67,47.05 113.98,47.05 125.09,47.05 | 125.09,47.05 125.73,47.05 144.46,47.05 144.46,39.12 154.31,39.12 v155.57,37.85 | IC1.4 125.09,47.05 | IC2.4 113.67,47.05 | IC3.4 99.69,47.05 | IC4.4 83.19,47.05 | IC7.4 60.33,47.05 | IC5.4 36.83,31.81 | v154.31,18.8 152.08,18.8 149.22,15.94 143.19,15.94 142.24,16.89 133.67,16.89 133.35,16.57 126.05,16.57 125.09,16.57 | 125.09,16.57 113.98,16.57 113.67,16.57 | 113.67,16.57 100.01,16.57 99.69,16.57 | 99.69,16.57 83.5,16.57 83.19,16.57 | 83.19,16.57 60.96,16.57 60.33,16.57 | 60.33,16.57 56.52,16.57 PR3..E | IC4..4 83.19,16.57 | IC3..4 99.69,16.57 | IC7..4 60.33,16.57 | IC2..4 113.67,16.57 | IC1..4 125.09,16.57
BIAS
  Bottom 0.61: R36.2 R35.1 R16.1
BIAS2
  Bottom 0.61: R36..2 R35..1 R16..1
EXCITATION_IN  (via drill 0.6)
  Top 0.61: v80.64,38.8 80.64,57.21 PAD3.1 | PAD4.1 80.64,2.6 80.64,6.73 | 80.64,6.73 v80.64,22.29 | P9..1 80.64,6.73
  Bottom 0.61: v80.64,38.8 80.64,31.81 | 80.64,31.81 CE4.+ | 80.64,31.81 v80.64,22.29
GND  (via drill 0.5)
  Top 0.61: P16.1 51.44,34.99 43.18,43.24 43.18,49.59 45.09,51.5 45.09,54.04 RE7.1 | PR5.E 76.2,50.23 PR5.S0 PR5.S | 147.32,41.97 PR1.E | IC2.5 112.08,42.93 112.08,49.91 116.2,54.04 116.2,56.58 C6.1 | IC2..5 109.22,15.3 109.22,22.61 117.47,22.61 C6..1 | PR5..S PR5..S0 76.2,19.75 PR5..E | 126.36,3.24 143.51,3.24 143.51,5.14 RE4..1
  Bottom 0.61: RV1.1A 1.35,50.15 1.27,50.23 | 1.27,50.23 1.27,59.12 28.26,59.12 | 31.91,45.31 31.75,45.15 PR4.S | 31.91,45.31 33.02,46.42 R18.2 | 28.26,59.12 Q2.B 28.26,45.47 PR4.S | 28.26,59.12 46.99,59.12 | 46.99,59.12 57.15,59.12 | P16.1 RE9.1 | RE7.1 46.99,59.12 | P12.1 60.33,54.67 RE6.1 57.15,59.12 | 1.27,50.23 1.27,19.75 | 1.27,19.75 1.27,0.7 28.57,0.7 | 89.22,29.27 85.72,29.27 84.77,28.32 84.77,24.19 C7..2 | 89.22,29.27 94.93,29.27 95.57,28.64 100.97,28.64 101.6,29.27 117.47,29.27 | 117.47,29.27 125.09,29.27 | 159.07,29.91 159.07,43.88 | 159.07,43.88 159.07,59.12 156.21,59.12 | 156.21,59.12 143.83,59.12 | RE1.1 143.83,59.12 | 143.83,59.12 125.73,59.12 | 117.47,59.12 84.77,59.12 | 84.77,59.12 57.15,59.12 | C6.1 117.47,59.12 | 117.47,59.12 125.73,59.12 | 125.73,59.12 RE2.1 | 159.07,43.88 PR1.S PR1.S0 149.86,41.34 PR1.E | P4.1 RE4.1 145.73,29.91 POWER.2 159.07,29.91 | PAD15.1 156.21,59.12 | 159.07,13.4 159.07,2.6 PAD16.1 153.67,5.14 RE4..1 P4..1 | 159.07,13.4 159.07,29.91 | C6..1 117.47,29.27 | 57.47,28.64 52.7,28.64 52.7,25.46 RE7..1 | 57.47,28.64 72.71,28.64 72.71,38.48 74.3,40.07 PR5.S 81.92,40.07 R36.1 89.22,32.77 89.22,29.27 | P12..1 57.47,27.05 57.47,28.64 | 125.09,0.7 88.58,0.7 | 28.57,0.7 52.7,0.7 RE9..1 | 1.27,19.75 1.19,19.75 RV1..1A | 157.48,13.4 159.07,13.4 | PR5..S 73.66,7.05 73.66,0.7 | PR4..S 31.75,14.67 33.02,15.94 R18..2 | P16..1 52.7,2.6 | 52.7,1.65 RE9..1 | 28.57,0.7 Q2..B PR4..S | RE2..1 125.09,29.27 | 125.09,29.27 P8.1 | 88.58,0.7 88.58,4.19 87.63,5.14 R36..1 | 73.66,0.7 88.58,0.7 | 73.66,0.7 63.5,0.7 61.28,2.92 53.02,2.92 52.7,2.6 | 52.7,2.6 52.7,1.65 | 52.7,1.65 53.02,1.33 RE9..1 | PR4.S PR4.S0 | PR4.S 31.91,45.15 31.91,45.31
  Bottom 0.61: PR4..S0 PR4..S | PR1..S0 152.4,13.4 | C7.2 84.77,54.67 84.77,59.12 | C23.1 C3.2 | C18.1 C9.2
  Bottom 0.813: PR1..S 157.48,13.4 152.4,13.4 PR1..E
  other vias: 17.14,20.38 137.79,37.85 2.54,25.46 135.89,54.99 147.96,53.72 96.84,8.32
  pour Bottom: -5.08,60.71 160.66,60.71 160.66,-0.89 -4.76,-0.89
  pour Top: -2.86,62.61 -2.86,-2.16 161.93,-2.16 161.93,62.61
N$1
  Bottom 0.61: RE3.1 124.14,51.18 RE2.2 128.59,51.18 | 128.59,51.18 128.59,50.55 IC1.2 | P2.2 128.59,51.18
N$2
  Bottom 0.61: P2.1 CE2.1 P3.1 P1.1 147.32,50.23 PR1.A
N$3
  Bottom 0.61: P5.1 IC1.1 132.4,48.96 131.13,50.23 131.13,54.99 129.54,56.58 CE2.2 128.27,56.58 124.46,56.58 RE3.2
N$4
  Top 0.61: R8.1 101.6,30.54 114.3,30.54 116.2,32.45 116.2,38.8 | 116.2,38.8 IC2.6 | R7.2 116.2,38.8
  Bottom 0.61: R8.1 R9.1
N$5
  Top 0.61: P5.2 133.03,38.8 | 133.03,38.8 131.76,38.8 CE3.1 | RE4.2 138.11,33.72 133.03,38.8
  Bottom 0.61: P7.1 CE3.1 P6.1
N$6
  Bottom 0.61: IC1.6 RE5.2 133.67,32.77 P6.2
N$7
  Bottom 0.61: 122.56,35.62 122.56,32.45 P8.2 P8.3 | 122.56,35.62 P7.2 | 122.56,35.62 122.56,38.8 IC1.5
N$8
  Top 0.61: IC1.7 127.64,43.88 125.09,43.88 123.19,41.97 123.19,40.07 124.46,38.8 R7.1
  Bottom 0.61: CE3.2 133.67,38.8 | 133.67,38.8 132.72,38.8 IC1.7 | 133.67,38.8 RE5.1
N$9
  Top 0.61: D1.C 114.94,38.8 114.94,47.69 IC2.3
  Bottom 0.61: R8.2 108.58,32.45 D1.C
N$10
  Bottom 0.61: IC2.7 119.38,40.7 119.38,38.16 118.43,37.21 116.52,37.21 113.67,34.35 D1.A D2.C
N$11
  Bottom 0.61: R10.1 D2.A 108.58,35.62 R9.2
N$12
  Bottom 0.61: R10.2 110.49,50.86 R11.1 116.2,51.5 IC2.2
N$13
  Bottom 0.61: IC2.1 R11.2 R12.1
N$14
  Bottom 0.61: C5.2 104.46,55.31 R13.1 110.49,55.31 R12.2
N$15
  Top 0.61: IC3.6 102.23,43.88 104.78,46.42 IC3.2 106.05,50.23 C5.1
  Bottom 0.61: R15.2 99.06,38.8 R14.1 102.23,38.8 IC3.6
N$16
  Top 0.61: IC3.3 103.5,50.23 103.5,53.4 101.6,55.31 R13.2
  Bottom 0.61: C6.2 111.76,57.21 101.92,57.21 R13.2
N$17
  Top 0.61: Q1.D2 83.5,57.85 84.77,59.12 89.85,59.12 91.12,57.85 Q1.D 92.71,55.31 92.71,50.23 R16.2
  Bottom 0.61: R16.2 R15.1
N$18
  Bottom 0.61: IC4.3 85.72,50.55 C7.1 87.63,54.36 88.58,55.31 Q1.S
N$19
  Top 0.61: Q1.G 86.04,55.31 87,54.36 D3.A
  Bottom 0.61: D3.A 92.39,54.36 94.93,51.82 R17.2
N$20
  Top 0.61: IC5.3 42.86,30.23 79.06,30.23 80.96,32.13 80.96,36.58 IC4.6 88.27,43.88 IC4.2
  Bottom 0.61: IC4.2 88.27,50.23 R17.1
N$21
  Bottom 0.61: R18.1 33.02,39.43 36.2,36.26 D4.C 39.37,36.26 IC5.2
N$22
  Bottom 0.61: IC5.1 D4.A PR2.E
N$23
  Bottom 0.61: PR2.A 39.37,42.61 PR2.S0 PR2.S 39.37,51.5 38.1,52.77 R19.1 Q2.E
N$24
  Bottom 0.61: R19.2 45.72,50.23 PR3.S PR3.S0
N$25
  Bottom 0.61: R20.2 30.8,49.28 Q2.C
N$26
  Bottom 0.61: R31.2 PR4.A
N$27
  Top 0.61: P9.2 79.06,38.48 79.06,49.91 PR5.A
  Bottom 0.61: CE5.2 P10.2 73.03,57.85 76.2,54.67 P11.1 78.74,53.72 PR5.A
N$28
  Bottom 0.61: 67.94,31.81 CE6.2 P14.2 | P15.1 53.98,38.16 55.56,36.58 55.56,33.72 57.47,31.81 RE9.2 67.94,31.81 | 67.94,31.81 P13.2
N$29
  Top 0.61: P10.1 71.75,53.09 67.63,53.09 65.41,50.86 IC7.2
  Bottom 0.61: IC7.2 62.87,51.5 RE8.1 59.05,51.5 RE7.2
N$30
  Top 0.61: P13.1 72.07,37.53 72.07,44.83 IC7.1
  Bottom 0.61: IC7.1 RE8.2 66.04,51.5 64.14,53.4 64.14,55.31 CE5.1
N$31
  Top 0.61: RE10.1 51.44,49.59 51.44,47.69 53.98,45.15 59.05,45.15 IC7.6
  Bottom 0.61: P14.1 IC7.6
N$32
  Bottom 0.61: P16.2 P16.3 P15.2 IC7.5
N$33
  Bottom 0.61: R29.1 10.79,45.15 8.26,45.15 | IC6.8 8.26,35.62 8.26,45.15 | C12.2 5.08,57.21 6.67,55.63 6.67,51.82 8.26,50.23 8.26,45.15
N$34
  Bottom 0.61: C12.1 8.26,52.77 R30.1
N$35
  Top 0.61: RE10.2 48.26,51.5 48.26,43.88 52.39,39.75 63.82,39.75 IC7.7
  Bottom 0.61: R27.1 43.81,55.94 RE10.2 | CE6.1 65.41,37.21 IC7.7
N$36
  Bottom 0.61: R32.1 PR4.E
N$37
  Bottom 0.61: IC6.3 26.04,36.89 R32.2
N$38
  Top 0.61: IC6.2 27.94,36.26 31.43,36.26 R28.1
N$39
  Top 0.61: R27.2 27.62,55.94 26.04,54.36 R31.1
  Bottom 0.61: R31.1 21.59,48.32 21.59,34.99 IC6.4
N$40
  Bottom 0.61: IC6.1 30.48,36.26 R20.1
N$41
  Top 0.61: RV1.1E 4.37,40.15 6.35,38.16 6.35,32.45 8.26,30.54 15.88,30.54 17.78,32.45 IC6.5
N$42
  Top 0.61: RV1.1S 7.62,41.34 7.62,33.08 8.89,31.81 12.06,31.81 12.7,32.45 IC6.7
N$43
  Top 0.61: CE1.- 140.97,45.15 P1.2 RE1.2
N$44
  Top 0.61: P3.2 136.84,47.69 136.84,46.42 | 136.84,46.42 130.18,46.42 IC1.3 | P4.2 140.65,38.8 136.84,42.61 136.84,46.42
N$45
  Top 0.61: CE4.- 86.04,33.4 P9.1
N$46
  Top 0.61: RE6.2 60.01,53.09 62.87,53.09 | 62.87,53.09 64.45,54.67 P12.2 P11.2 | IC7.3 62.87,53.09
N$47
  Bottom 0.61: RE3..1 124.46,21.02 RE2..2 128.59,21.02 | 128.59,21.02 130.18,19.43 IC1..2 | 128.59,21.02 P2..1
N$48
  Bottom 0.61: PR1..A 147.32,22.92 144.15,26.1 P1..1 P3..1 138.11,26.1 P2..3 P2..2 CE2..1
N$49
  Bottom 0.61: P5..1 IC1..1 132.72,22.61 128.91,26.42 128.59,26.42 | RE3..2 124.14,26.42 128.59,26.42 | 128.59,26.42 CE2..2
N$50
  Top 0.61: 132.72,7.05 132.72,8.32 135.25,10.86 P5..3 P5..2 | 132.72,7.05 130.49,7.05 CE3..1 | RE4..2 136.21,7.05 132.72,7.05
  Bottom 0.61: P7..1 CE3..1 | P6..1 140.65,5.14 RE4..2
N$51
  Bottom 0.61: IC1..6 RE5..2 134.3,1.97 P6..3 P6..2
N$52
  Bottom 0.61: P8..2 117.47,3.87 P7..2 124.78,10.86 IC1..5
N$53
  Top 0.61: R7..1 124.46,8.32 123.19,9.59 123.19,11.49 125.09,13.4 127.64,13.4 IC1..7
  Bottom 0.61: CE3..2 133.67,8.64 | 133.67,8.64 132.4,8.64 IC1..7 | RE5..1 133.67,8.64
N$54
  Top 0.61: IC2..6 116.2,8.32 | 116.2,8.32 116.2,4.83 114.94,3.56 101.28,3.56 R8..1 | R7..2 116.2,8.32
  Bottom 0.61: R9..1 R8..1
N$55
  Top 0.61: D1..C 114.94,8.32 114.94,17.21 IC2..3
  Bottom 0.61: R8..2 108.58,1.97 D1..C
N$56
  Bottom 0.61: D2..C D1..A 113.67,2.29 119.38,8 119.38,10.22 IC2..7
N$57
  Bottom 0.61: R9..2 108.58,5.14 D2..A R10..1
N$58
  Bottom 0.61: R10..2 110.49,20.38 R11..1 116.2,21.02 IC2..2
N$59
  Bottom 0.61: IC2..1 R11..2 R12..1
N$60
  Bottom 0.61: C5..2 103.82,24.83 R13..1 110.49,24.83 R12..2
N$61
  Top 0.61: C5..1 105.73,19.43 IC3..2 104.78,15.94 102.23,13.4 IC3..6
  Bottom 0.61: IC3..6 102.23,8.32 R14..1 99.06,8.32 R15..2
N$62
  Top 0.61: IC3..3 103.82,20.38 103.82,23.88 102.87,24.83 R13..2
  Bottom 0.61: R13..2 102.23,27.37 C6..2
N$63
  Top 0.61: Q1..D2 83.5,27.69 84.77,28.96 89.85,28.96 91.12,27.69 Q1..D 92.71,24.83 92.71,19.75 R16..2
  Bottom 0.61: R16..2 R15..1
N$64
  Bottom 0.61: IC4..3 85.72,20.07 C7..1 87.63,23.88 88.58,24.83 Q1..S
N$65
  Top 0.61: D3..A 86.68,23.88 86.04,24.51 Q1..G
  Bottom 0.61: D3..A 92.39,21.34 R17..2
N$66
  Top 0.61: IC4..6 88.27,13.4 IC4..2 81.92,24.83 81.92,27.05 80.01,28.96 39.69,28.96 IC5.5
  Bottom 0.61: IC4..2 88.27,19.75 R17..1
N$67
  Top 0.61: IC5.6 39.37,23.56 35.56,19.75 35.56,13.4 | 35.56,13.4 R18..1 | D4..C 39.37,8.32 39.37,11.81 37.78,13.4 35.56,13.4
N$68
  Bottom 0.61: IC5.7 41.27,25.46 41.27,21.65 42.55,20.38 42.55,10.22 PR2..E D4..A
N$69
  Bottom 0.61: R19..1 38.1,22.29 39.37,21.02 PR2..S PR2..S0 39.37,12.13 PR2..A 34.61,7.37 Q2..E
N$70
  Bottom 0.61: R19..2 45.72,19.75 PR3..S PR3..S0
N$71
  Bottom 0.61: R20..2 30.48,8.32 31.11,7.68 Q2..C
N$72
  Bottom 0.61: R31..2 PR4..A
N$73
  Top 0.61: PR5..A P9..2 P9..3 | CE5..2 P10..1
  Bottom 0.61: PR5..A 78.74,21.34 P11..1 72.71,27.37 P10..1
N$74
  Bottom 0.61: P14..3 P14..2 CE6..2 69.53,2.6 P13..1
N$75
  Top 0.61: IC7..2 65.41,21.02 66.99,22.61 68.58,22.61 71.75,25.78 73.34,25.78 74.93,27.37 P10..2 P10..3
  Bottom 0.61: RE7..2 59.05,21.02 RE8..1 62.87,21.02 IC7..2
N$76
  Top 0.61: P13..3 P13..2 73.03,5.14 73.03,13.4 IC7..1
  Bottom 0.61: CE5..1 RE8..2 IC7..1
N$77
  Top 0.61: IC7..7 65.41,9.59 | 65.41,9.59 48.9,9.59 | 48.9,9.59 48.9,20.38 RE10..2 | R27..1 46.99,3.87 48.9,5.78 48.9,9.59 | CE6..1 65.41,6.41 65.41,9.59
N$78
  Bottom 0.61: R32..1 PR4..E
N$79
  Top 0.61: IC6.14 21.59,24.83 21.59,11.49 R32..2
N$80
  Top 0.61: IC6.15 25.4,27.37 26.67,28.64 28.57,28.64 R28..1
N$81
  Bottom 0.61: IC6.13 20.32,23.56 21.59,22.29 | 21.59,22.29 R31..1 | R27..2 21.59,7.05 21.59,22.29
N$82
  Top 0.61: R20..1 27.94,18.48 IC6.16
N$83
  Top 0.61: IC6.10 12.7,27.37 12.06,28 6.67,28 6.67,15.62 5.71,14.67 RV1..1S
N$84
  Bottom 0.61: IC6.9 8.57,24.51 8.26,24.51 | 8.26,24.51 8.26,22.92 9.53,21.65 11.43,21.65 R29..1 | 8.26,24.51 3.17,29.59 C12..2
N$85
  Bottom 0.61: R30..1 8.89,19.75 6.67,21.97 6.67,23.88 C12..1
N$86
  Top 0.61: RE10..1 51.44,19.11 51.44,17.21 53.98,14.67 59.05,14.67 IC7..6
  Bottom 0.61: IC7..6 P14..1
N$87
  Bottom 0.61: IC7..5 59.05,9.59 P15..2 59.05,5.78 P16..2
N$88
  Top 0.61: P15..1 RE9..2
N$89
  Top 0.61: P3..2 138.11,19.75 138.11,15.94 | 138.11,15.94 130.18,15.94 IC1..3 | 138.11,15.94 P4..2
N$91
  Top 0.61: IC7..3 62.87,22.61 64.45,24.19 P12..2
  Bottom 0.61: P12..2 70.8,24.19 P11..2
N$92
  Top 0.61: IC6.12 17.78,26.73 15.24,29.27 2.54,29.27 1.27,28 1.27,10.22 1.91,9.59 3.73,9.59 RV1..1E
OUT1
  Top 0.61: PAD1.1 15.24,56.26 J1.3 15.24,38.16 19.05,34.35 19.05,25.46 15.24,21.65 J2.3 15.24,3.56 PAD2.1
OUT2  (via drill 0.6)
  Top 0.61: PAD17.1 13.97,56.26 13.97,53.09 13.02,52.13 10.48,52.13 8.26,49.91 8.26,45.15 | 8.26,45.15 8.26,42.61 10.16,40.7 J1.1 | 8.26,8.95 8.26,5.14 10.79,2.6 PAD18.1 | J2.1 8.26,8.95 | 8.26,8.95 v8.26,26.73 | v6.99,45.15 8.26,45.15
  Bottom 0.61: v8.26,26.73 6.99,28 v6.99,45.15
OUTPUT_AMP
  Bottom 0.61: R30.2 12.7,40.7 J1.2
OUTPUT_AMP_2
  Bottom 0.61: R30..2 12.7,10.22 J2.2
SLEW_RATE_CTRL
  Top 0.61: PAD11.1 95.25,3.87 95.25,23.56 D3..C 95.25,24.19 95.25,54.04 D3.C 94.93,56.26 PAD12.1
SPEECH_IN
  Top 0.61: PAD6.1 147.64,3.56 147.64,8.64 141.92,14.35 141.92,18.48 | 141.92,18.48 P1..3 P1..2 | 144.15,45.15 142.94,45.09 CE1.+ 142.94,45.21 144.15,45.15 | 144.15,45.15 144.15,29.59 141.92,27.37 141.92,18.48 | 144.15,45.15 144.15,47.05 146.69,49.59 PAD5.1
VU_DETECTOR
  Top 0.61: PAD7.1 98.42,55.94 98.42,53.72 99.06,53.09 99.06,50.86 98.42,50.23 98.42,37.21 | R14.2 105.73,37.21 98.42,37.21 | 98.42,37.21 JP1.1
VU_DETECTOR_2
  Top 0.61: JP1.2 98.11,27.05 98.11,23.24 99.06,22.29 99.06,20.38 98.11,19.43 98.11,6.73 | R14..2 105.73,6.73 98.11,6.73 | 98.11,6.73 97.16,5.78 PAD8.1

### Text on the board
tPlace: + | +
tNames: D | G | S | D | Channel number | N/C ch 13 | PR3 | speech / gain | cv offset | PR4 | vca offset | Excit. gain | 2 | 1 | PR2 cv / gain | Out | 4V&B | Analysis/ / synthesis | D | G | S | D | N/C between / ch 9&10 | V/UV bus | PR4 | PR3 cv offset | speech / gain | vca offset | Excit. gain | 2 | 1 | Out | PR2 | cv gain | N/C / ch / 12 | ETI | Vocoder | Channel number
bNames: Out 2 | Out 1 | Excit / input | Slew | V/UV | Speech | +12v | -12v | gnd | Channel: | 2 | 1 | 1 / 3 / 5 / 7 / 9 / 11 / 13 | -12v | Output buses: | Gnd | 1: Ch 1,2,4,6,8,10,12,14 | 2: Ch 3,5,7,9,11,13 | +12v | Channel: | 2 | 1 | 2 / 4 / 6 / 8 / 10 / 12 / 14 | ETI / Vocoder | Analysis/synthesis / board v1.0